# Altium project smoker_ctrl.PrjPcb
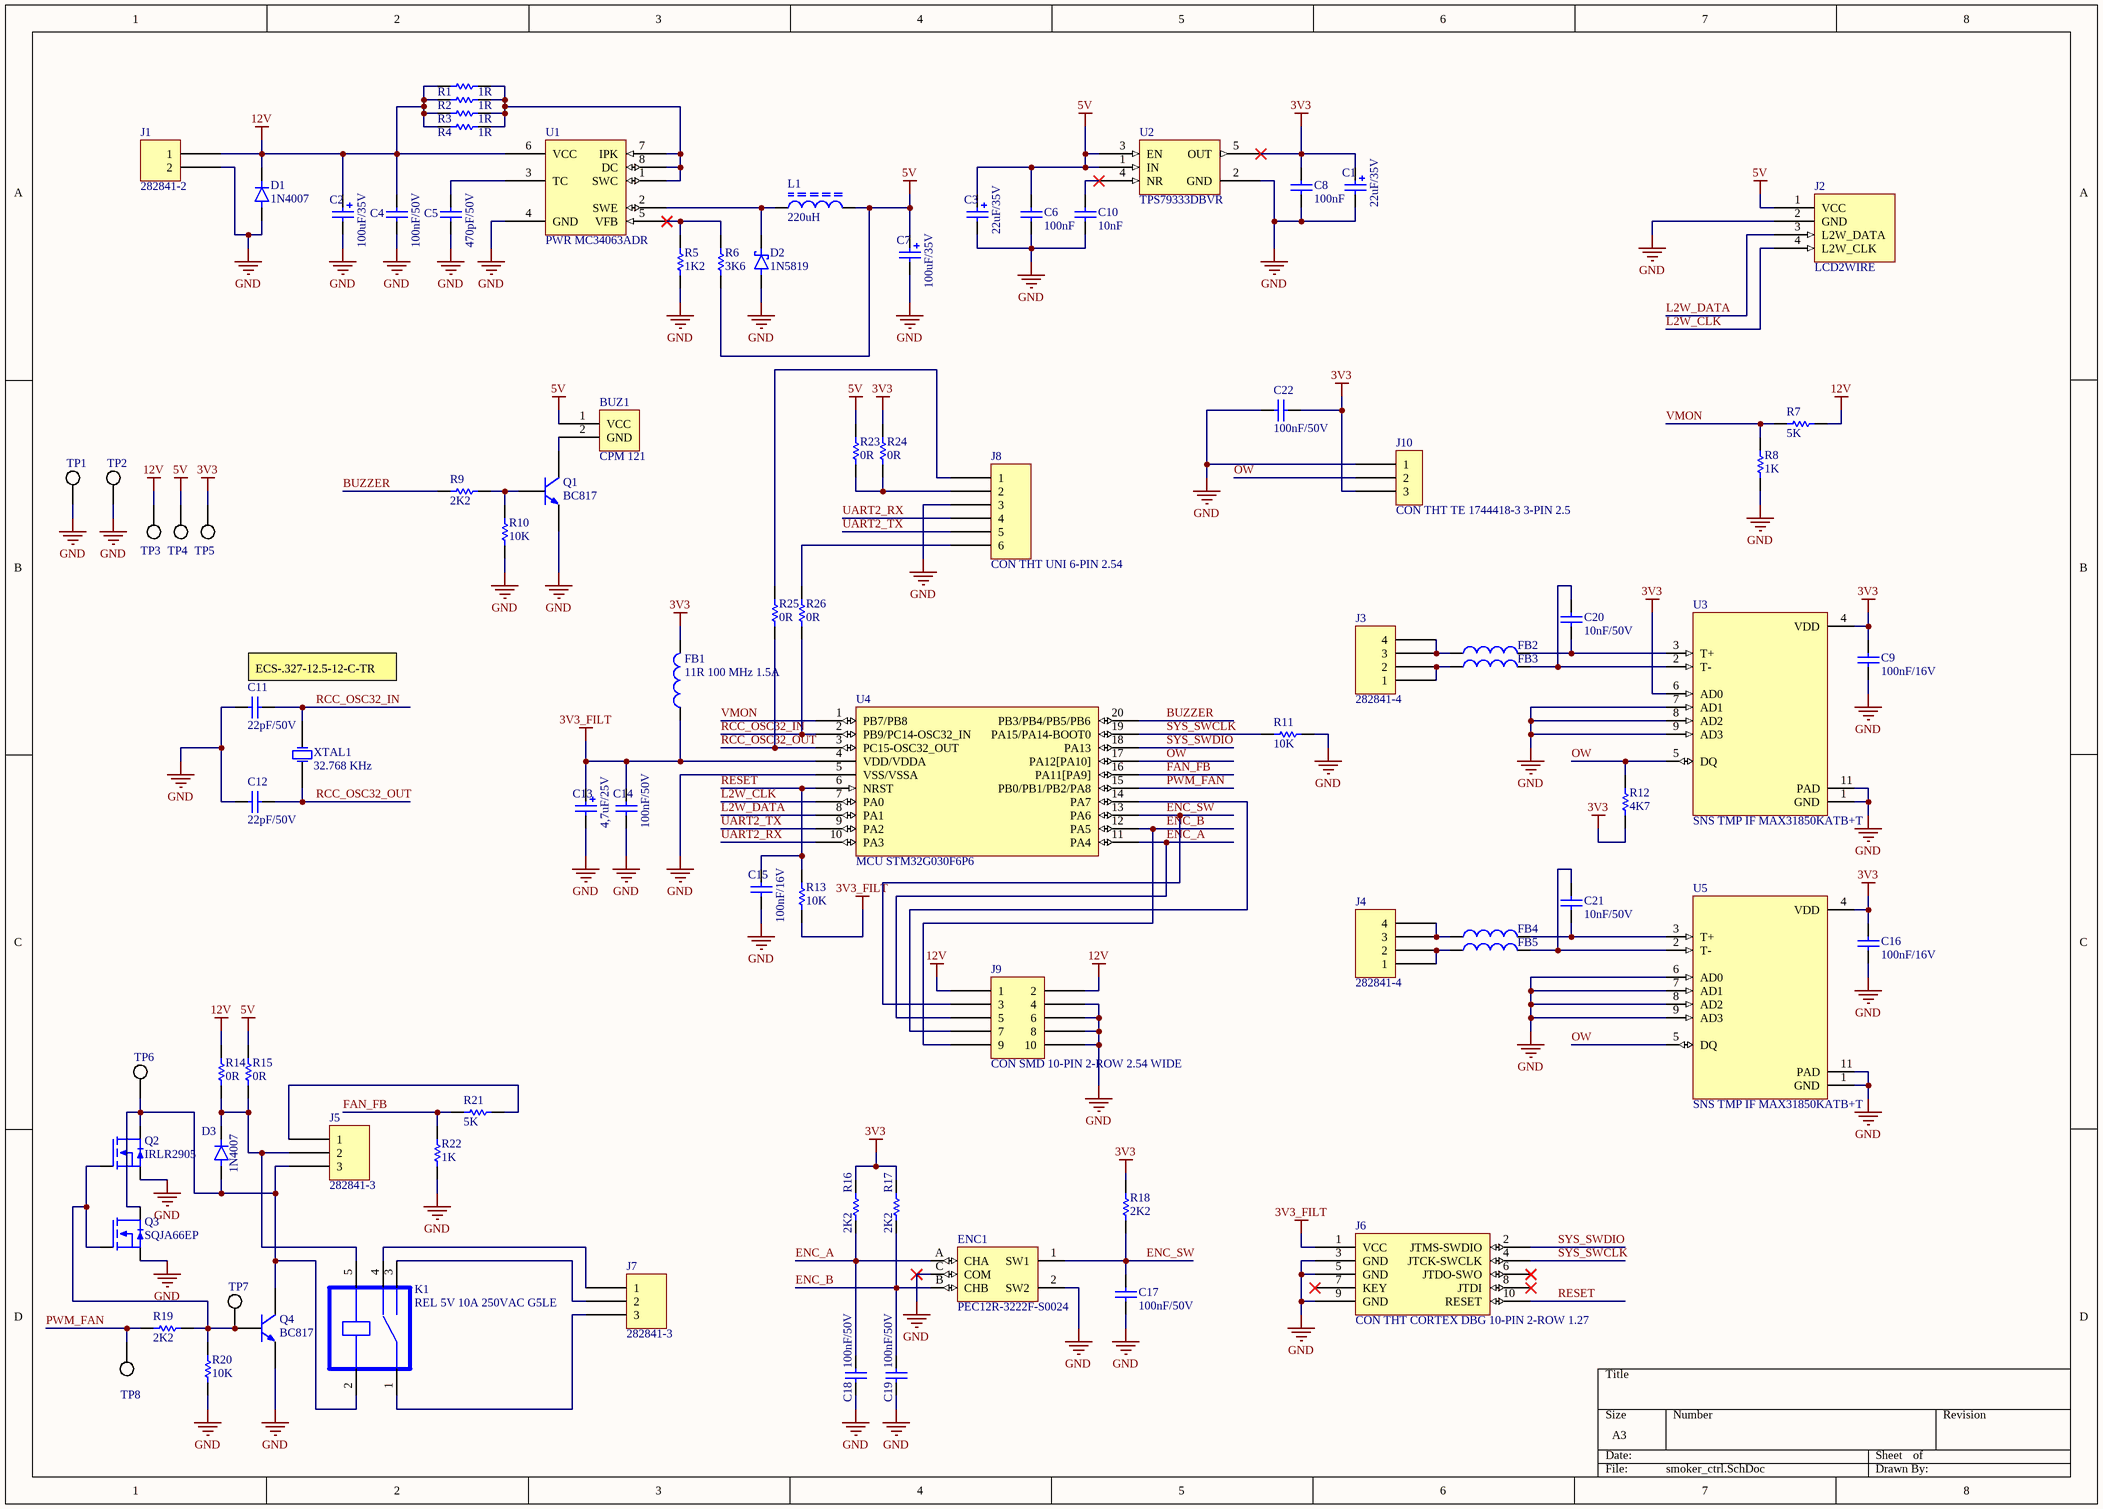
[diagram p0: smoker_ctrl.SchDoc]
1 sheet, 88 parts. Net scope: global (net labels, ports and power ports of the same name join across sheets).
Board file: smoker_ctrl.PcbDoc

## Sheet smoker_ctrl.SchDoc
size A3

### Parts
BUZ1  CPM 121  [THT SND BUZ 14MM]
C1  22uF/35V  [THT CAP RAD D5.0mm P2.5mm]
C2  100uF/35V  [THT CAP RAD D10.0mm P5.0mm]
C3  22uF/35V  [THT CAP RAD D5.0mm P2.5mm]
C4  100nF/50V  [SMD 0805 GENERIC]
C5  470pF/50V  [SMD 1206 GENERIC]
C6  100nF  [SMD 0603 GENERIC]
C7  100uF/35V  [THT CAP RAD D10.0mm P5.0mm]
C8  100nF  [SMD 0603 GENERIC]
C9  100nF/16V  [SMD 0402 GENERIC]
C10  10nF  [SMD 0603 GENERIC]
C11  22pF/50V  [SMD 0805 GENERIC]
C12  22pF/50V  [SMD 0805 GENERIC]
C13  4,7uF/25V  [SMD 2312 POLARIZED]
C14  100nF/50V  [SMD 0805 GENERIC]
C15  100nF/16V  [SMD 0603 GENERIC]
C16  100nF/16V  [SMD 0402 GENERIC]
C17  100nF/50V  [SMD 0805 GENERIC]
C18  100nF/50V  [SMD 0805 GENERIC]
C19  100nF/50V  [SMD 0805 GENERIC]
C20  10nF/50V  [SMD 0402 GENERIC]
C21  10nF/50V  [SMD 0402 GENERIC]
C22  100nF/50V  [SMD 0805 GENERIC]
D1  1N4007  [THT DO-41]
D2  1N5819  [THT DO-41]
D3  1N4007  [THT DO-41]
ENC1  PEC12R-3222F-S0024  [THT REN PEC12R-3222F-S0024]
FB1  11R 100 MHz 1.5A  [SMD 0805 GENERIC]
FB2  11R 100 MHz 1.5A  [SMD 0805 GENERIC]  (value not drawn)
FB3  11R 100 MHz 1.5A  [SMD 0805 GENERIC]  (value not drawn)
FB4  11R 100 MHz 1.5A  [SMD 0805 GENERIC]  (value not drawn)
FB5  11R 100 MHz 1.5A  [SMD 0805 GENERIC]  (value not drawn)
J1  282841-2  [THT CON 2-PIN 5.08]
J2  LCD2WIRE  [THT CON 4-PIN 2.54 WHITE]
J3  282841-4  [THT CON 4-PIN 5.08]
J4  282841-4  [THT CON 4-PIN 5.08]
J5  282841-3  [THT CON 3-PIN 5.08]
J6  CON THT CORTEX DBG 10-PIN 2-ROW 1.27  [THT HEADER 2x5 1.27]
J7  282841-3  [THT CON 3-PIN 5.08]
J8  CON THT UNI 6-PIN 2.54  [THT CON UNI 6-PIN 2.54]
J9  CON SMD 10-PIN 2-ROW 2.54 WIDE  [SMD HEADER 2x5 2.54 WIDE]
J10  CON THT TE 1744418-3 3-PIN 2.5  [THT CON TE 1744418-3 2.5]
K1  REL 5V 10A 250VAC G5LE  [THT RELAY G5LE]
L1  220uH  [SMD IND SRR1210]
Q1  BC817  [SOT23-3]
Q2  IRLR2905  [SMD D-PAK (TO252AA)]
Q3  SQJA66EP  [SMD PowerPAK SO-8L]
Q4  BC817  [SOT23-3]
R1  1R  [SMD 1206 GENERIC]
R2  1R  [SMD 1206 GENERIC]
R3  1R  [SMD 1206 GENERIC]
R4  1R  [SMD 1206 GENERIC]
R5  1K2  [SMD 1206 GENERIC]
R6  3K6  [SMD 1206 GENERIC]
R7  5K  [SMD 0603 GENERIC]
R8  1K  [SMD 0603 GENERIC]
R9  2K2  [SMD 0805 GENERIC]
R10  10K  [SMD 0805 GENERIC]
R11  10K  [SMD 0805 GENERIC]
R12  4K7  [SMD 0603 GENERIC]
R13  10K  [SMD 0603 GENERIC]
R14  0R  [SMD 0603 GENERIC]
R15  0R  [SMD 0603 GENERIC]
R16  2K2  [SMD 0805 GENERIC]
R17  2K2  [SMD 0805 GENERIC]
R18  2K2  [SMD 0805 GENERIC]
R19  2K2  [SMD 0805 GENERIC]
R20  10K  [SMD 0805 GENERIC]
R21  5K  [SMD 0603 GENERIC]
R22  1K  [SMD 0603 GENERIC]
R23  0R  [SMD 0603 GENERIC]
R24  0R  [SMD 0603 GENERIC]
R25  0R  [SMD 0603 GENERIC]
R26  0R  [SMD 0603 GENERIC]
TP1  TPT SMD 200  [SMD TP 2.0mm]  (value not drawn)
TP2  TPT SMD 200  [SMD TP 2.0mm]  (value not drawn)
TP3  TPT SMD 200  [SMD TP 2.0mm]  (value not drawn)
TP4  TPT SMD 200  [SMD TP 2.0mm]  (value not drawn)
TP5  TPT SMD 200  [SMD TP 2.0mm]  (value not drawn)
TP6  TPT SMD 200  [SMD TP 2.0mm]  (value not drawn)
TP7  TPT SMD 200  [SMD TP 2.0mm]  (value not drawn)
TP8  TPT SMD 200  [SMD TP 2.0mm]  (value not drawn)
U1  PWR MC34063ADR  [SOIC-8]
U2  TPS79333DBVR  [SOT23-5]
U3  SNS TMP IF MAX31850KATB+T  [TDFN-10]
U4  MCU STM32G030F6P6  [TSOP-20]
U5  SNS TMP IF MAX31850KATB+T  [TDFN-10]
XTAL1  32.768 KHz  [SMD-2 XTAL 2.0mmx1.2mm]

### Nets
3V3: C1.1 C8.2 C9.2 C16.2 C22.1 FB1.2 J10.3 R12.1 R16.2 R17.2 R18.2 R24.2 TP5.1 U2.5(OUT) U3.4(VDD) U3.6(AD0) U5.4(VDD)
3V3_FILT: C13.1 C14.1 FB1.1 J6.1(VCC) R13.1 U4.4(VDD/VDDA)
5V: BUZ1.1(VCC) C3.1 C6.2 C7.1 J2.1(VCC) L1.2 R6.1 R15.2 R23.2 TP4.1 U2.1(IN) U2.3(EN)
12V: C2.1 C4.2 D1.K J1.1 J9.1 J9.2 R1.1 R2.1 R3.1 R4.1 R7.2 R14.2 TP3.1 U1.6(VCC)
GND: C1.2 C2.2 C3.2 C4.1 C5.1 C6.1 C7.2 C8.1 C9.1 C10.1 C11.1 C12.1 C13.2 C14.2 C15.1 C16.1 C17.1 C18.1 C19.1 C22.2 D1.A D2.A ENC1.2(SW2) ENC1.C(COM) J1.2 J2.2(GND) J6.3(GND) J6.5(GND) J6.9(GND) J8.3 J9.4 J9.6 J9.8 J9.10 J10.1 Q1.2(Emitter) Q2.3(Source) Q3.1(Source) Q4.2(Emitter) R5.1 R8.1 R10.1 R11.2 R20.1 R22.1 TP1.1 TP2.1 U1.4(GND) U2.2(GND) U3.1(GND) U3.7(AD1) U3.8(AD2) U3.9(AD3) U3.11(PAD) U4.5(VSS/VSSA) U5.1(GND) U5.6(AD0) U5.7(AD1) U5.8(AD2) U5.9(AD3) U5.11(PAD)
BUZZER: R9.1 U4.20(PB3/PB4/PB5/PB6)
ENC_A: C18.2 ENC1.A(CHA) J9.5 R16.1 U4.11(PA4)
ENC_B: C19.2 ENC1.B(CHB) J9.9 R17.1 U4.12(PA5)
ENC_SW: C17.2 ENC1.1(SW1) J9.3 R18.1 U4.13(PA6)
FAN_FB: R21.1 R22.2 U4.16(PA11[PA9])
L2W_CLK: J2.4(L2W_CLK) U4.7(PA0)
L2W_DATA: J2.3(L2W_DATA) U4.8(PA1)
OW: J10.2 R12.2 U3.5(DQ) U4.17(PA12[PA10]) U5.5(DQ)
PWM_FAN: R19.1 TP8.1 U4.15(PB0/PB1/PB2/PA8)
RCC_OSC32_IN: C11.2 R26.1 U4.2(PB9/PC14-OSC32_IN) XTAL1.2(OSC2)
RCC_OSC32_OUT: C12.2 R25.1 U4.3(PC15-OSC32_OUT) XTAL1.1(OSC1)
RESET: C15.2 J6.10(RESET) R13.2 U4.6(NRST)
SYS_SWCLK: J6.4(JTCK-SWCLK) R11.1 U4.19(PA15/PA14-BOOT0)
SYS_SWDIO: J6.2(JTMS-SWDIO) U4.18(PA13)
UART2_RX: J8.4 U4.10(PA3)
UART2_TX: J8.5 U4.9(PA2)
VMON: R7.1 R8.2 U4.1(PB7/PB8)
NetBUZ1_2: BUZ1.2(GND) Q1.3(Collector)
NetC5_2: C5.2 U1.3(TC)
NetC10_2: C10.2 U2.4(NR)
NetC20_1: C20.1 FB2.2 U3.3(T+)
NetC20_2: C20.2 FB3.2 U3.2(T-)
NetC21_1: C21.1 FB4.2 U5.3(T+)
NetC21_2: C21.2 FB5.2 U5.2(T-)
NetD2_K: D2.K L1.1 U1.2(SWE)
NetD3_A: D3.A J5.3 K1.2 Q2.4(Drain) Q3.5(Drain) Q4.3(Collector) TP6.1
NetD3_K: D3.K J5.2 K1.5 R14.1 R15.1
NetFB2_1: FB2.1 J3.3 J3.4
NetFB3_1: FB3.1 J3.1 J3.2
NetFB4_1: FB4.1 J4.3 J4.4
NetFB5_1: FB5.1 J4.1 J4.2
NetJ5_1: J5.1 R21.2
NetJ7_1: J7.1 K1.4
NetJ7_2: J7.2 K1.3
NetJ7_3: J7.3 K1.1
NetJ8_1: J8.1 R25.2
NetJ8_2: J8.2 R23.1 R24.1
NetJ8_6: J8.6 R26.2
NetJ9_7: J9.7 U4.14(PA7)
NetQ1_1: Q1.1(Base) R9.2 R10.2
NetQ2_1: Q2.1(Gate) Q3.4(Gate) Q4.1(Base) R19.2 R20.2 TP7.1
NetR1_2: R1.2 R2.2 R3.2 R4.2 U1.1(SWC) U1.7(IPK) U1.8(DC)
NetR5_2: R5.2 R6.2 U1.5(VFB)

Not connected (* = marked no-connect by the designer): J6 6(JTDO-SWO)* 7(KEY)* 8(JTDI)*

### Notes on the sheet
- (near C11) ECS-.327-12.5-12-C-TR

### Library data of the parts
BUZ1 = SND BUZ 3-15 VDC 14MM CPM 121
C1 C3 = CAP THT ELC RAD 22uF 35V 20% D5.0mm P2.5mm
C2 C7 = CAP THT ELC RAD 100uF 35V 20% D10.0mm P5.0mm
C4 C14 C17-C19 C22 = CAP SMD CER 100nF 50V 10% X7R 0805
C5 = CAP SMD CER 470pF 50V 5% C0G 1206
C6 C8 C15 = CAP SMD CER 100nF 16V 10% X7R 0603
C9 C16 = CAP SMD CER 100nF 16V 10% X7R 0402
C10 = CAP SMD CER 10nF 16V 10% X7R 0603
C11 C12 = CAP SMD CER 22pF 50V 5% C0G 0805
C13 = CAP SMD TAN 4,7uF 25V 10% 2312
C20 C21 = CAP SMD CER 10nF 50V 10% X7R 0402
D1 D3 = SEM GEN 1000V 1A DO-41 1N4007
D2 = SEM SCH 40V 1A DO-41 1N5819
ENC1 = REN 24PPR THT VER PEC12R-3222F-S0024
FB1-FB5 = FBD SMD 11R 100MHz 1.5A 0805
J1 = CON THT TERMINAL BLOCK  2-PIN 5.08
J2 = CON THT LCD2WIRE 4-PIN 2.54
J3 J4 = CON THT TERMINAL BLOCK  4-PIN 5.08
J5 J7 = CON THT TERMINAL BLOCK  3-PIN 5.08
J9 = CON SMD 10-PIN 2-ROW 2.54 WIDE: HTST-105-01-SM-DV-P
L1 = IND SMD 220uH 1.7A SRR1210
Q1 Q4 = SEM BJT NPN 45V 500mA BC817
Q2 = SEM FET NCH IRLR2905
Q3 = SEM FET NCH SQJA66EP
R1-R4 = RES SMD 1R 1% 1206
R5 = RES SMD 1K2 1% 1206
R6 = RES SMD 3K6 1% 1206
R7 R21 = RES SMD 5K 1% 0603
R8 R22 = RES SMD 1K 1% 0603
R9 R16-R19 = RES SMD 2K2 1% 0805
R10 R11 R20 = RES SMD 10K 1% 0805
R12 = RES SMD 4K7 1% 0603
R13 = RES SMD 10K 1% 0603
R14 R15 R23-R26 = RES SMD 0R 0603
U2 = PWR TPS79333DBVR
XTAL1 = XTAL SMD 32.768 KHz 2.0mmx1.2mm